# Altium schematic sheet CM3_Power.SchDoc: =DocumentName
size A4; Author: Leihonglun; CompanyName: SoundWedge; DocumentNumber: 3; SheetNumber: 3; SheetTotal: 4; SheetTitle: CM3_Power.SchDoc
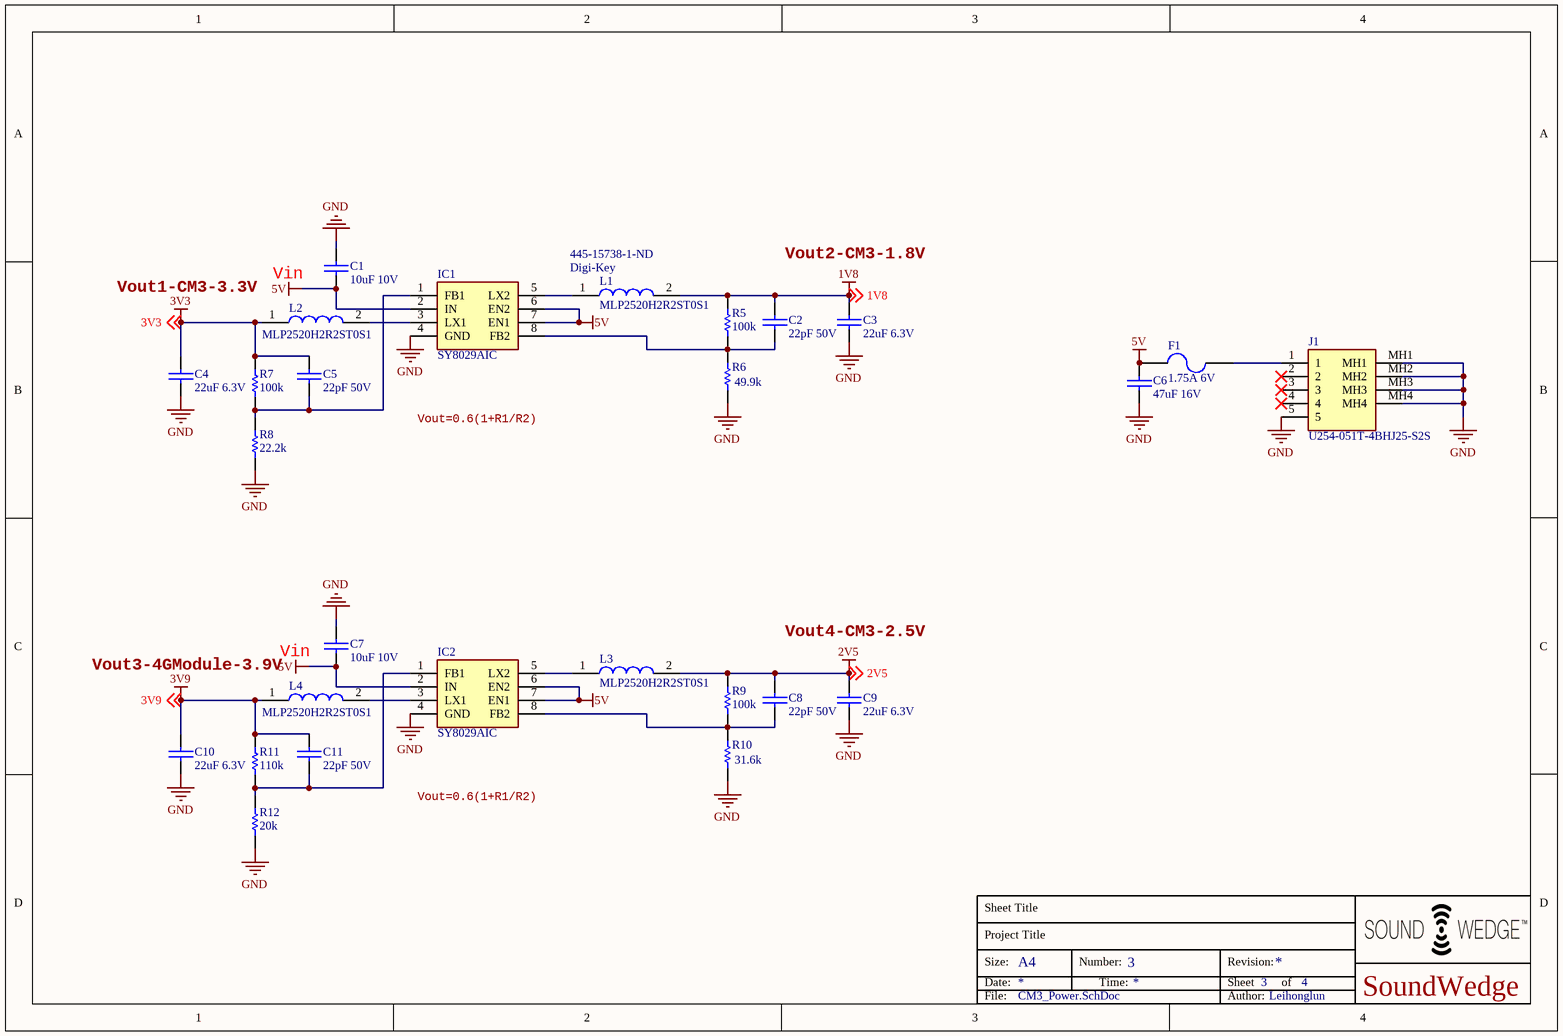
[diagram p0: CM3_Power.SchDoc]

## Parts
C1  10uF 10V  [0805C]
C2  22pF 50V  [0402C]
C3  22uF 6.3V  [0603C]
C4  22uF 6.3V  [0603C]
C5  22pF 50V  [0402C]
C6  47uF 16V  [1210C]
C7  10uF 10V  [0805C]
C8  22pF 50V  [0402C]
C9  22uF 6.3V  [0603C]
C10  22uF 6.3V  [0603C]
C11  22pF 50V  [0402C]
F1  1.75A 6V  [FUSE-1210]
IC1  SY8029AIC  [SOT65P280X110-8N]
IC2  SY8029AIC  [SOT65P280X110-8N]
J1  U254-051T-4BHJ25-S2S  [U254051T4BHJ25S2S]
L1  MLP2520H2R2ST0S1  Supplier 1: Digi-Key  Supplier Part Number 1: 445-15738-1-ND  [INDC2520X100N]
L2  MLP2520H2R2ST0S1  [INDC2520X100N]
L3  MLP2520H2R2ST0S1  [INDC2520X100N]
L4  MLP2520H2R2ST0S1  [INDC2520X100N]
R5  100k  [0402R]
R6  49.9k  [0402R]
R7  100k  [0402R]
R8  22.2k  [0402R]
R9  100k  [0402R]
R10  31.6k  [0402R]
R11  110k  [0402R]
R12  20k  [0402R]

## Nets
1V8: C2.2 C3.2 L1.2 R5.2 ; off-sheet 1V8
2V5: C8.2 C9.2 L3.2 R9.2 ; off-sheet 2V5
3V3: C4.2 C5.2 L2.1 R7.2 ; off-sheet 3V3
3V9: C10.2 C11.2 L4.1 R11.2 ; off-sheet 3V9
5V: C1.1 C6.2 C7.1 F1.1 IC1.2(IN) IC1.6(EN2) IC1.7(EN1) IC2.2(IN) IC2.6(EN2) IC2.7(EN1)
GND: C1.2 C3.1 C4.1 C6.1 C7.2 C9.1 C10.1 IC1.4(GND) IC2.4(GND) J1.5 J1.MH1 J1.MH2 J1.MH3 J1.MH4 R6.1 R8.1 R10.1 R12.1
NetC2_1: C2.1 IC1.8(FB2) R5.1 R6.2
NetC5_1: C5.1 IC1.1(FB1) R7.1 R8.2
NetC8_1: C8.1 IC2.8(FB2) R9.1 R10.2
NetC11_1: C11.1 IC2.1(FB1) R11.1 R12.2
NetF1_2: F1.2 J1.1
NetIC1_3: IC1.3(LX1) L2.2
NetIC1_5: IC1.5(LX2) L1.1
NetIC2_3: IC2.3(LX1) L4.2
NetIC2_5: IC2.5(LX2) L3.1

Not connected (* = marked no-connect by the designer): J1 2* 3* 4*

## Notes on the sheet
- Vout2-CM3-1.8V
- Vout1-CM3-3.3V
- Vin
- Vout=0.6(1+R1/R2)
- (near L4) Vout3-4GModule-3.9V
- Vout4-CM3-2.5V
- Sheet Title
- Project Title
- Size:
- Date:
- A4
- Number:
- Time:
- Revision:
- Sheet
- of
- File:
- Author:

## Library data of the parts
C1-C11 = CAP-NP
F1 = FUSE
IC1 IC2 = SY8029AIC: Integrated Circuit; Manufacturer_Name: Silergy Corp; Datasheet Link: https://datasheet.lcsc.com/szlcsc/Silergy-Corp-SY8029AIC_C207636.pdf; Height: 1.1mm; Manufacturer_Part_Number: SY8029AIC
J1 = U254-051T-4BHJ25-S2S: Connector; Manufacturer_Name: XKB Enterprise; Datasheet Link: https://datasheet.lcsc.com/szlcsc/2002271812_XKB-Enterprise-U254-051T-4BHJ25-S2S_C319163.pdf; Height: 2.9mm; Manufacturer_Part_Number: U254-051T-4BHJ25-S2S
L1-L4 = MLP2520K1R0MT0S1: Inductor; Manufacturer_Name: TDK; Datasheet Link: https://www.arrow.com/en/products/mlp2520k1r0mt0s1/tdk; Height: 1mm; Manufacturer_Part_Number: MLP2520K1R0MT0S1; Arrow Part Number: MLP2520K1R0MT0S1; Arrow Price/Stock: https://www.arrow.com/en/products/mlp2520k1r0mt0s1/tdk; Mouser Part Number: 810-MLP2520K1R0MT0S1; Mouser Price/Stock: https://www.mouser.com/Search/Refine.aspx?Keyword=810-MLP2520K1R0MT0S1
  L3: Parameter 1: *
R5-R12 = RES